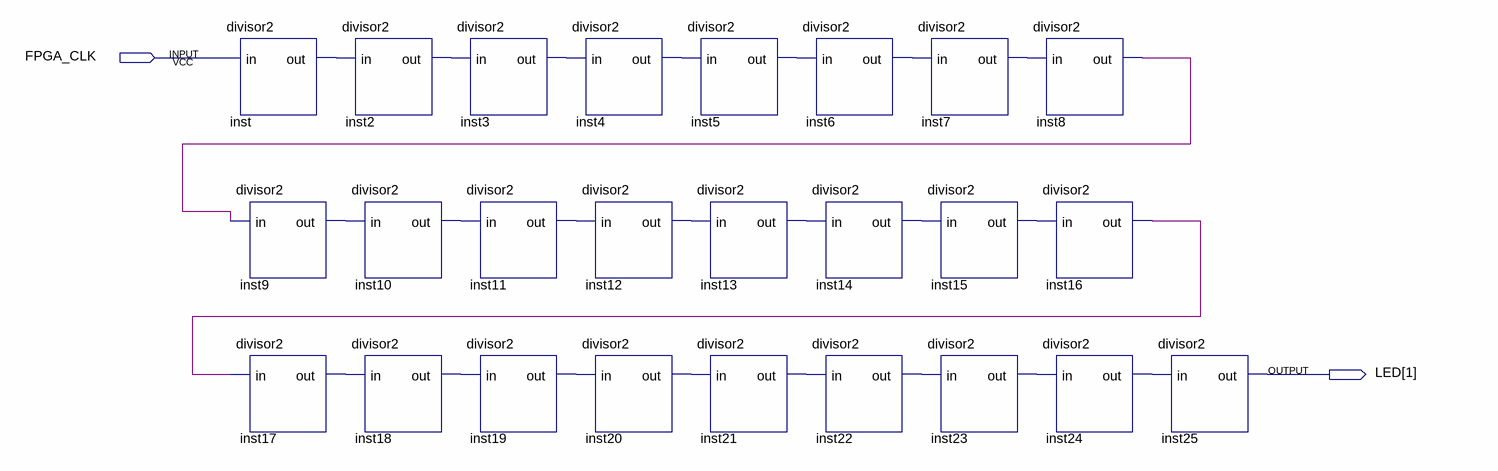
[diagram p0: schematic sheet]
// Quartus schematic clk_195312.bdf as structural Verilog: 25 symbols, 2 pins
module clk_195312 (
  input  FPGA_CLK,
  output [1:1] LED
);

  wire inst2_out, inst3_out, inst4_out, inst5_out, inst6_out, inst7_out, inst8_out, inst9_out, inst10_out,
       inst11_out, inst12_out, inst13_out, inst14_out, inst15_out, inst16_out, inst17_out, inst18_out,
       inst19_out, inst20_out, inst21_out, inst22_out, inst23_out, inst24_out, inst_out;

  divisor2 inst (.in(FPGA_CLK), .out(inst_out));
  divisor2 inst9 (.in(inst8_out), .out(inst9_out));
  divisor2 inst17 (.in(inst16_out), .out(inst17_out));
  divisor2 inst2 (.in(inst_out), .out(inst2_out));
  divisor2 inst10 (.in(inst9_out), .out(inst10_out));
  divisor2 inst18 (.in(inst17_out), .out(inst18_out));
  divisor2 inst3 (.in(inst2_out), .out(inst3_out));
  divisor2 inst11 (.in(inst10_out), .out(inst11_out));
  divisor2 inst19 (.in(inst18_out), .out(inst19_out));
  divisor2 inst4 (.in(inst3_out), .out(inst4_out));
  divisor2 inst12 (.in(inst11_out), .out(inst12_out));
  divisor2 inst20 (.in(inst19_out), .out(inst20_out));
  divisor2 inst5 (.in(inst4_out), .out(inst5_out));
  divisor2 inst13 (.in(inst12_out), .out(inst13_out));
  divisor2 inst21 (.in(inst20_out), .out(inst21_out));
  divisor2 inst6 (.in(inst5_out), .out(inst6_out));
  divisor2 inst14 (.in(inst13_out), .out(inst14_out));
  divisor2 inst22 (.in(inst21_out), .out(inst22_out));
  divisor2 inst7 (.in(inst6_out), .out(inst7_out));
  divisor2 inst15 (.in(inst14_out), .out(inst15_out));
  divisor2 inst23 (.in(inst22_out), .out(inst23_out));
  divisor2 inst8 (.in(inst7_out), .out(inst8_out));
  divisor2 inst16 (.in(inst15_out), .out(inst16_out));
  divisor2 inst24 (.in(inst23_out), .out(inst24_out));
  divisor2 inst25 (.in(inst24_out), .out(LED[1]));
endmodule
